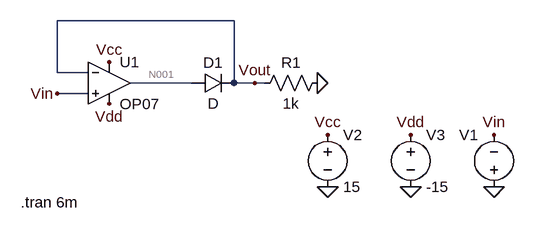
[diagram p0: schematic Diode2.asc]
Diode2.asc, the LTspice schematic file:
Version 4
SHEET 1 880 680
WIRE 240 48 -32 48
WIRE -32 128 -32 48
WIRE 16 128 -32 128
WIRE 176 144 80 144
WIRE 240 144 240 48
WIRE 272 144 240 144
WIRE 288 144 272 144
WIRE 16 160 -32 160
FLAG 384 304 0
FLAG 512 304 0
FLAG 384 224 Vcc
FLAG 48 112 Vcc
FLAG 512 224 Vdd
FLAG 48 176 Vdd
FLAG 640 224 Vin
FLAG -32 160 Vin
FLAG 640 304 0
FLAG 368 144 0
FLAG 272 144 Vout
SYMBOL diode 176 160 R270
WINDOW 0 32 32 VTop 2
WINDOW 3 0 32 VBottom 2
SYMATTR InstName D1
SYMBOL Opamps\\OP07 48 80 R0
SYMATTR InstName U1
SYMBOL voltage 640 320 R180
WINDOW 0 24 96 Left 2
WINDOW 3 24 16 Invisible 2
WINDOW 123 0 0 Left 0
WINDOW 39 0 0 Left 0
SYMATTR InstName V1
SYMATTR Value PULSE(-2 2 0 0.5m 0.5m 1p 1m)
SYMBOL voltage 384 208 R0
WINDOW 123 0 0 Left 0
WINDOW 39 0 0 Left 0
SYMATTR InstName V2
SYMATTR Value 15
SYMBOL voltage 512 208 R0
WINDOW 123 0 0 Left 0
WINDOW 39 0 0 Left 0
SYMATTR InstName V3
SYMATTR Value -15
SYMBOL res 384 128 R90
WINDOW 0 0 56 VBottom 2
WINDOW 3 32 56 VTop 2
SYMATTR InstName R1
SYMATTR Value 1k
TEXT -88 328 Left 2 !.tran 6m

The netlist it stands for:
* Diode2.asc
D1 N001 Vout D
XU1 Vin Vout Vcc Vdd N001 LT1001  ; OP07, pins In+ In- V+ V- OUT
V1 0 Vin PULSE(-2 2 0 0.5m 0.5m 1p 1m)
V2 Vcc 0 15
V3 Vdd 0 -15
R1 0 Vout 1k
.model D D
.lib standard.dio
.tran 6m
.lib LTC.lib
.backanno
.end

* Results of the author's LTspice run, read from the files saved beside the schematic
* Operating Point, zero values left out:
*   V(n001) = 2.673 V
*   V(vout) = 2 V
*   V(vin) = 2 V
*   V(vcc) = 15 V
*   V(vdd) = -15 V
*   I(D1) = 2 mA
*   I(R1) = -2 mA
*   I(V3) = 1.361 mA
*   I(V2) = -3.361 mA
*   I(V1) = 3.621 pA
*   Ix(u1:1) = 3.621 pA
*   Ix(u1:2) = 3.522 pA
*   Ix(u1:3) = 3.361 mA
*   Ix(u1:4) = -1.361 mA
*   Ix(u1:5) = -2 mA
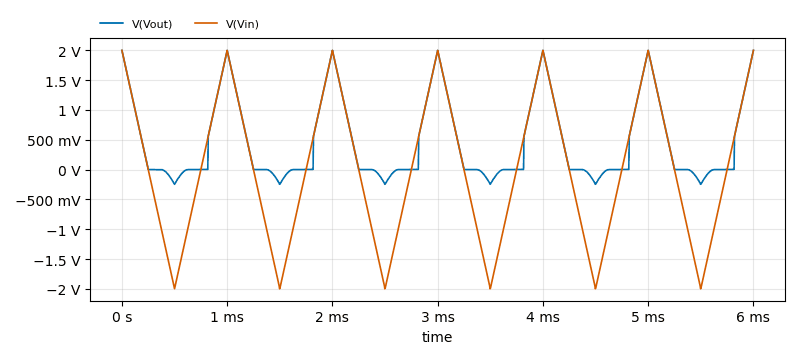
[diagram p1: Transient Analysis of Diode2.asc, plotted from the saved traces]
* Transient Analysis, 1 run:
*   V(Vout): min -246.5 mV, max 2 V, average 458.7 mV, rms 837.5 mV, last 1.998 V
*   V(Vin): min -2 V, max 2 V, average -33.38 µV, rms 1.179 V, last 2 V